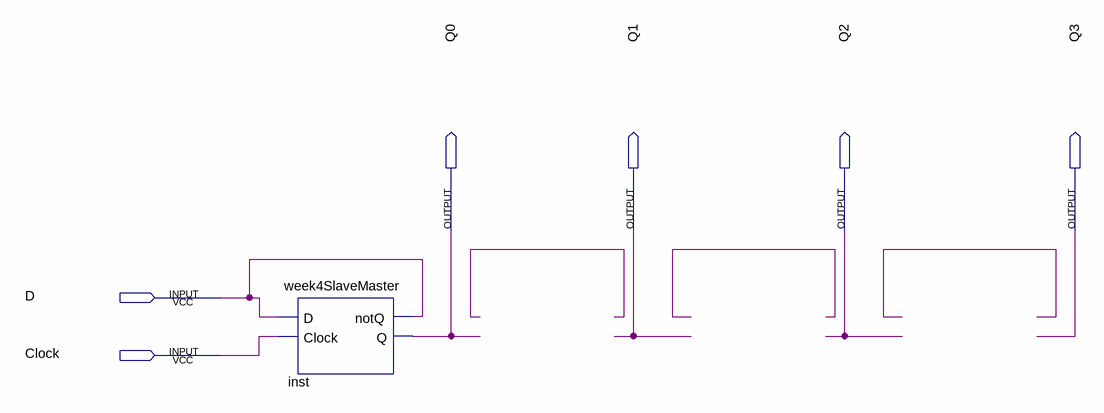
[diagram p0: schematic sheet]
// Quartus schematic week5.bdf as structural Verilog: 1 symbols, 6 pins
module week5 (
  input  D,
  input  Clock,
  output Q0,
  output Q1,
  output Q2,
  output Q3
);

  week4SlaveMaster inst (.D(D), .Clock(Clock), .notQ(D), .Q(Q0));
endmodule
